# Altium schematic sheet seven_segment_driver_sche2.SchDoc
size A
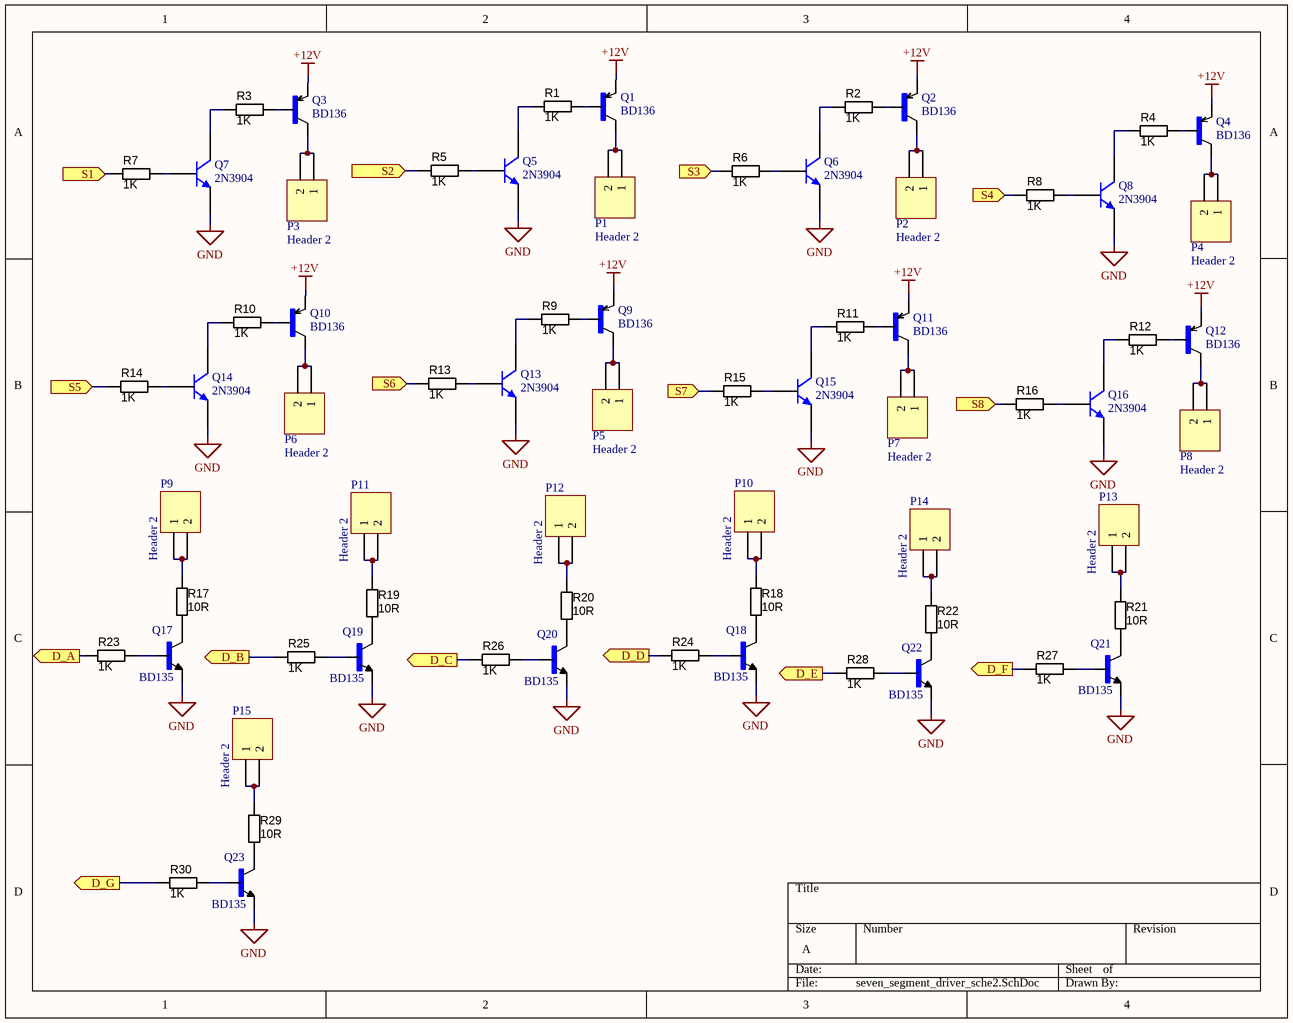
[diagram p0: seven_segment_driver_sche2.SchDoc]

## Parts
P1  Header 2  [HDR1X2]
P2  Header 2  [HDR1X2]
P3  Header 2  [HDR1X2]
P4  Header 2  [HDR1X2]
P5  Header 2  [HDR1X2]
P6  Header 2  [HDR1X2]
P7  Header 2  [HDR1X2]
P8  Header 2  [HDR1X2]
P9  Header 2  [HDR1X2]
P10  Header 2  [HDR1X2]
P11  Header 2  [HDR1X2]
P12  Header 2  [HDR1X2]
P13  Header 2  [HDR1X2]
P14  Header 2  [HDR1X2]
P15  Header 2  [HDR1X2]
Q1  BD136  [*TO229P780X300X2000-3]
Q2  BD136  [*TO229P780X300X2000-3]
Q3  BD136  [*TO229P780X300X2000-3]
Q4  BD136  [*TO229P780X300X2000-3]
Q5  2N3904  [TO-92_Flat]
Q6  2N3904  [TO-92_Flat]
Q7  2N3904  [TO-92_Flat]
Q8  2N3904  [TO-92_Flat]
Q9  BD136  [*TO229P780X300X2000-3]
Q10  BD136  [*TO229P780X300X2000-3]
Q11  BD136  [*TO229P780X300X2000-3]
Q12  BD136  [*TO229P780X300X2000-3]
Q13  2N3904  [TO-92_Flat]
Q14  2N3904  [TO-92_Flat]
Q15  2N3904  [TO-92_Flat]
Q16  2N3904  [TO-92_Flat]
Q17  BD135  [*TO229P780X300X2000-3]
Q18  BD135  [*TO229P780X300X2000-3]
Q19  BD135  [*TO229P780X300X2000-3]
Q20  BD135  [*TO229P780X300X2000-3]
Q21  BD135  [*TO229P780X300X2000-3]
Q22  BD135  [*TO229P780X300X2000-3]
Q23  BD135  [*TO229P780X300X2000-3]
R1  value 1K  [RESTH_AXIAL-0.4]  (hidden comment: Carbon Film)
R2  value 1K  [RESTH_AXIAL-0.4]  (hidden comment: Carbon Film)
R3  value 1K  [RESTH_AXIAL-0.4]  (hidden comment: Carbon Film)
R4  value 1K  [RESTH_AXIAL-0.4]  (hidden comment: Carbon Film)
R5  value 1K  [RESTH_AXIAL-0.4]  (hidden comment: Carbon Film)
R6  value 1K  [RESTH_AXIAL-0.4]  (hidden comment: Carbon Film)
R7  value 1K  [RESTH_AXIAL-0.4]  (hidden comment: Carbon Film)
R8  value 1K  [RESTH_AXIAL-0.4]  (hidden comment: Carbon Film)
R9  value 1K  [RESTH_AXIAL-0.4]  (hidden comment: Carbon Film)
R10  value 1K  [RESTH_AXIAL-0.4]  (hidden comment: Carbon Film)
R11  value 1K  [RESTH_AXIAL-0.4]  (hidden comment: Carbon Film)
R12  value 1K  [RESTH_AXIAL-0.4]  (hidden comment: Carbon Film)
R13  value 1K  [RESTH_AXIAL-0.4]  (hidden comment: Carbon Film)
R14  value 1K  [RESTH_AXIAL-0.4]  (hidden comment: Carbon Film)
R15  value 1K  [RESTH_AXIAL-0.4]  (hidden comment: Carbon Film)
R16  value 1K  [RESTH_AXIAL-0.4]  (hidden comment: Carbon Film)
R17  value 10R  [AXIAL-0.6]  (hidden comment: Metal Film)
R18  value 10R  [AXIAL-0.6]  (hidden comment: Metal Film)
R19  value 10R  [AXIAL-0.6]  (hidden comment: Metal Film)
R20  value 10R  [AXIAL-0.6]  (hidden comment: Metal Film)
R21  value 10R  [AXIAL-0.6]  (hidden comment: Metal Film)
R22  value 10R  [AXIAL-0.6]  (hidden comment: Metal Film)
R23  value 1K  [RESTH_AXIAL-0.4]  (hidden comment: Carbon Film)
R24  value 1K  [RESTH_AXIAL-0.4]  (hidden comment: Carbon Film)
R25  value 1K  [RESTH_AXIAL-0.4]  (hidden comment: Carbon Film)
R26  value 1K  [RESTH_AXIAL-0.4]  (hidden comment: Carbon Film)
R27  value 1K  [RESTH_AXIAL-0.4]  (hidden comment: Carbon Film)
R28  value 1K  [RESTH_AXIAL-0.4]  (hidden comment: Carbon Film)
R29  value 10R  [AXIAL-0.6]  (hidden comment: Metal Film)
R30  value 1K  [RESTH_AXIAL-0.4]  (hidden comment: Carbon Film)

## Ports
D_A (out), D_B (out), D_C (out), D_D (out), D_E (out), D_F (out), D_G (out), S1 (in), S2 (in), S3 (in), S4 (in), S5 (in), S6 (in), S7 (in), S8 (in)

## Nets
+12V: Q1.1(C) Q2.1(C) Q3.1(C) Q4.1(C) Q9.1(C) Q10.1(C) Q11.1(C) Q12.1(C)
GND: Q5.1(E) Q6.1(E) Q7.1(E) Q8.1(E) Q13.1(E) Q14.1(E) Q15.1(E) Q16.1(E) Q17.1(E) Q18.1(E) Q19.1(E) Q20.1(E) Q21.1(E) Q22.1(E) Q23.1(E)
D_A: R23.1 ; port D_A
D_B: R25.1 ; port D_B
D_C: R26.1 ; port D_C
D_D: R24.1 ; port D_D
D_E: R28.1 ; port D_E
D_F: R27.1 ; port D_F
D_G: R30.1 ; port D_G
S1: R7.1 ; port S1
S2: R5.1 ; port S2
S3: R6.1 ; port S3
S4: R8.1 ; port S4
S5: R14.1 ; port S5
S6: R13.1 ; port S6
S7: R15.1 ; port S7
S8: R16.1 ; port S8
NetP1_1: P1.1 P1.2 Q1.2(C)
NetP2_1: P2.1 P2.2 Q2.2(C)
NetP3_1: P3.1 P3.2 Q3.2(C)
NetP4_1: P4.1 P4.2 Q4.2(C)
NetP5_1: P5.1 P5.2 Q9.2(C)
NetP6_1: P6.1 P6.2 Q10.2(C)
NetP7_1: P7.1 P7.2 Q11.2(C)
NetP8_1: P8.1 P8.2 Q12.2(C)
NetP9_1: P9.1 P9.2 R17.1
NetP10_1: P10.1 P10.2 R18.1
NetP11_1: P11.1 P11.2 R19.1
NetP12_1: P12.1 P12.2 R20.1
NetP13_1: P13.1 P13.2 R21.1
NetP14_1: P14.1 P14.2 R22.1
NetP15_1: P15.1 P15.2 R29.1
NetQ1_3: Q1.3(B) R1.2
NetQ2_3: Q2.3(B) R2.2
NetQ3_3: Q3.3(B) R3.2
NetQ4_3: Q4.3(B) R4.2
NetQ5_2: Q5.2(B) R5.2
NetQ5_3: Q5.3(C) R1.1
NetQ6_2: Q6.2(B) R6.2
NetQ6_3: Q6.3(C) R2.1
NetQ7_2: Q7.2(B) R7.2
NetQ7_3: Q7.3(C) R3.1
NetQ8_2: Q8.2(B) R8.2
NetQ8_3: Q8.3(C) R4.1
NetQ9_3: Q9.3(B) R9.2
NetQ10_3: Q10.3(B) R10.2
NetQ11_3: Q11.3(B) R11.2
NetQ12_3: Q12.3(B) R12.2
NetQ13_2: Q13.2(B) R13.2
NetQ13_3: Q13.3(C) R9.1
NetQ14_2: Q14.2(B) R14.2
NetQ14_3: Q14.3(C) R10.1
NetQ15_2: Q15.2(B) R15.2
NetQ15_3: Q15.3(C) R11.1
NetQ16_2: Q16.2(B) R16.2
NetQ16_3: Q16.3(C) R12.1
NetQ17_2: Q17.2(C) R17.2
NetQ17_3: Q17.3(B) R23.2
NetQ18_2: Q18.2(C) R18.2
NetQ18_3: Q18.3(B) R24.2
NetQ19_2: Q19.2(C) R19.2
NetQ19_3: Q19.3(B) R25.2
NetQ20_2: Q20.2(C) R20.2
NetQ20_3: Q20.3(B) R26.2
NetQ21_2: Q21.2(C) R21.2
NetQ21_3: Q21.3(B) R27.2
NetQ22_2: Q22.2(C) R22.2
NetQ22_3: Q22.3(B) R28.2
NetQ23_2: Q23.2(C) R29.2
NetQ23_3: Q23.3(B) R30.2

## Library data of the parts
P1-P15 = Header 2: Header, 2-Pin; LatestRevisionDate: 17-Jul-2002; LatestRevisionNote: Re-released for DXP Platform.; Publisher: Altium Limited
Q5-Q8 Q13-Q16 = 2N3904: NPN General Purpose Amplifier; Published: 8-Jun-2000; LatestRevisionDate: 15-Jan-2003; LatestRevisionNote: PCB Footprint 'BCY-W3/D4.7' replaced; DatasheetVersion: 1997; PackageVersion: Sep-1998; PackageReference: TO-92A; Publisher: Altium Limited; PackageDescription: TO, Flat Index; 3 In-Line, Axial Leads; Body Dia. 4.5mm; Leads 0.51 x 0.48 mm (max); ComponentLink1Description: Manufacturer Link; ComponentLink1URL: http://www.fairchildsemi.com/; ComponentLink2Description: Datasheet; ComponentLink2URL: http://www.fairchildsemi.com/ds/2N%2F2N3904.pdf
Q17-Q23 = BD135: Trans GP BJT NPN 45V 1.5A 3-Pin TO-126; MF: ON Semiconductor; SnapEDA_Link: https://www.snapeda.com/parts/BD135/ON%20Semiconductor/view-part/?ref=snap; Price: None; MP: BD135; Availability: Unavailable; Package: TO-126-3 NXP Semiconductors; Value: *
R1-R16 R23-R28 R30 = RES_1K_Axial_0.25W_5%: Resistor THD Axial 1k Ohm 0.25W 5% Carbon Film; Manufacturer 1: Yageo; Manufacturer Part Number 1: CFR-25JB-1K0; Ratings: 1/4W; SCDType: spec; Tolerance: ±5%; Package / Case: Axial; Supplier 1: Digi-Key; Supplier Part Number 1: 1.0KQBK-ND
R17-R22 R29 = RES_10R_Axial_1W_5%: Resistor THD 10 Ohm 1W 5% Metal Film; Manufacturer 1: Vishay/BC Components; Manufacturer Part Number 1: PR01000101009JR500; SCDType: spec; Tolerance: ±5%; Package / Case: 2.5x8.0mm DxL; Ratings: 1W; Supplier 1: Digi-Key; Supplier Part Number 1: PPC10W-1CT-ND